# EAGLE schematic master_node_1284p (EAGLE 6.5.0)
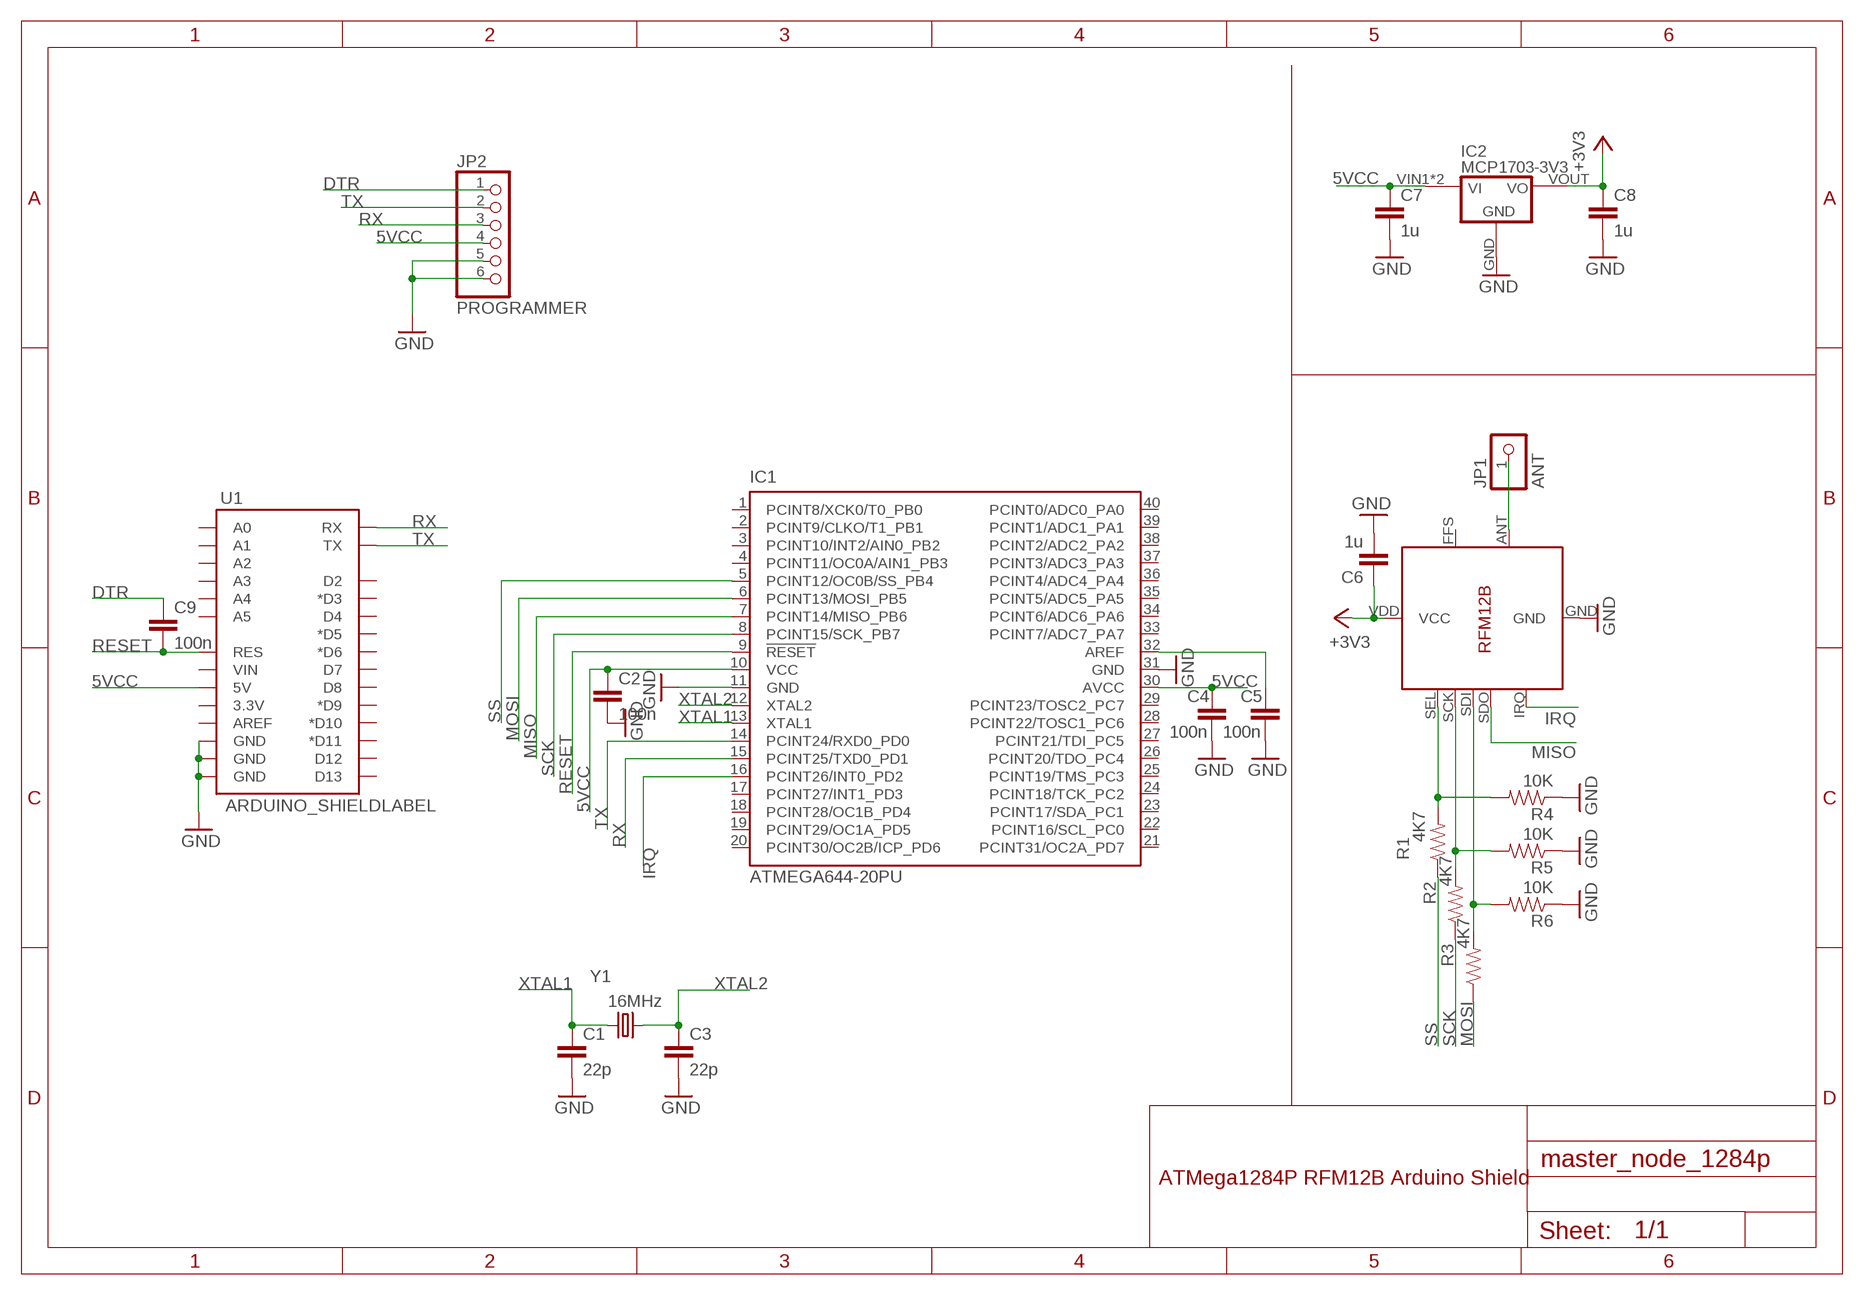
[diagram p0: schematic, sheet 1]

## Parts
C1  22p  C-EUC0805K  [C0805K]
C2  100n  C-EUC0805K  [C0805K]
C3  22p  C-EUC0805K  [C0805K]
C4  100n  C-EUC0805K  [C0805K]
C5  100n  C-EUC0805K  [C0805K]
C6  1u  CAP0805  [0805]
C7  1u  CAP0805  [0805]
C8  1u  CAP0805  [0805]
C9  100n  C-EUC0805K  [C0805K]
IC1  ATMEGA644-20PU  [DIL40]
IC2  MCP1703-3V3  MCP1703-SOT89  [MCP1703-SOT89]
JP1  ANT  PINHD-1X1  [1X01]
JP2  PROGRAMMER  PINHD-1X6/90  [1X06/90]
R1  4K7  RESISTOR0805-RES  [0805]
R2  4K7  RESISTOR0805-RES  [0805]
R3  4K7  RESISTOR0805-RES  [0805]
R4  10K  RESISTOR0805-RES  [0805]
R5  10K  RESISTOR0805-RES  [0805]
R6  10K  RESISTOR0805-RES  [0805]
U1  ARDUINO_SHIELDLABEL  [DUEMILANOVE_SHIELD]
U$1  RFM12B  [RFM12B]
Y1  16MHz  CRYSTALHC49US  [HC49US]

## Nets
5VCC: C2.1 C4.1 C7.1 IC1.10(VCC) IC1.30(AVCC) IC2.VIN1(VI) IC2.VIN2(VI) JP2.4 U1.5V
+3V3: C6.1 C8.1 IC2.VOUT(VO) U$1.VDD(VCC)
DTR: C9.1 JP2.1
GND: C1.2 C2.2 C3.2 C4.2 C5.2 C6.2 C7.2 C8.2 IC1.11(GND) IC1.31(GND) IC2.GND JP2.5 JP2.6 R4.1 R5.1 R6.1 U1.GND@0(GND) U1.GND@1(GND) U1.GND@2(GND) U$1.GND
IRQ: IC1.16(PCINT26/INT0_PD2) U$1.IRQ
MISO: IC1.7(PCINT14/MISO_PB6) U$1.SDO
MOSI: IC1.6(PCINT13/MOSI_PB5) R3.1
N$7: JP1.1 U$1.ANT
N$18: C5.1 IC1.32(AREF)
N$35: R3.2 R6.2 U$1.SDI
N$36: R2.2 R5.2 U$1.SCK
N$37: R1.2 R4.2 U$1.SEL
RESET: C9.2 IC1.9(!RESET) U1.RES
RX: IC1.15(PCINT25/TXD0_PD1) JP2.3 U1.RX
SCK: IC1.8(PCINT15/SCK_PB7) R2.1
SS: IC1.5(PCINT12/OC0B/SS_PB4) R1.1
TX: IC1.14(PCINT24/RXD0_PD0) JP2.2 U1.TX
XTAL1: C1.1 IC1.13(XTAL1) Y1.1
XTAL2: C3.1 IC1.12(XTAL2) Y1.2
Unconnected: IC1.1(PCINT8/XCK0/T0_PB0) IC1.2(PCINT9/CLKO/T1_PB1) IC1.3(PCINT10/INT2/AIN0_PB2) IC1.4(PCINT11/OC0A/AIN1_PB3) IC1.17(PCINT27/INT1_PD3) IC1.18(PCINT28/OC1B_PD4) IC1.19(PCINT29/OC1A_PD5) IC1.20(PCINT30/OC2B/ICP_PD6) IC1.21(PCINT31/OC2A_PD7) IC1.22(PCINT16/SCL_PC0) IC1.23(PCINT17/SDA_PC1) IC1.24(PCINT18/TCK_PC2) IC1.25(PCINT19/TMS_PC3) IC1.26(PCINT20/TDO_PC4) IC1.27(PCINT21/TDI_PC5) IC1.28(PCINT22/TOSC1_PC6) IC1.29(PCINT23/TOSC2_PC7) IC1.33(PCINT7/ADC7_PA7) IC1.34(PCINT6/ADC6_PA6) IC1.35(PCINT5/ADC5_PA5) IC1.36(PCINT4/ADC4_PA4) IC1.37(PCINT3/ADC3_PA3) IC1.38(PCINT2/ADC2_PA2) IC1.39(PCINT1/ADC1_PA1) IC1.40(PCINT0/ADC0_PA0) U1.3.3V U1.A0 U1.A1 U1.A2 U1.A3 U1.A4 U1.A5 U1.AREF U1.D2 U1.D3(*D3) U1.D4 U1.D5(*D5) U1.D6(*D6) U1.D7 U1.D8 U1.D9(*D9) U1.D10(*D10) U1.D11(*D11) U1.D12 U1.D13 U1.VIN U$1.FFS

## Notes on the sheet
- ATMega1284P RFM12B Arduino Shield

## Library data of the parts
C1-C5 C9 = resistor:C-EU: CAPACITOR, European symbol
C6-C8 = SparkFun-Passives:CAP: Capacitor Standard 0603 ceramic capacitor, and 0.1" leaded capacitor.
IC1 = atmel:ATMEGA644-*PU: 8-bit Microcontroller with 64K Bytes In-System Programmable Flash Auto generated by make-symbol-device-package-bsdl.ulp Rev. 34 Source: http://www.atmel.com/dyn/resources/prod_documents/doc2593.pdf; MPN: ATMEGA644-20PU; OC_FARNELL: 1288340; OC_NEWARK: 23M5060
IC2 = MCP1703_SOT89:MCP1703-SOT89
JP1 = pinhead:PINHD-1X1: PIN HEADER
JP2 = pinhead:PINHD-1X6: PIN HEADER
R1-R6 = SparkFun-Resistors:RESISTOR: Resistor Basic schematic elements and footprints for 0603, 1206, and PTH resistors.
U1 = SparkFun-Boards:ARDUINO_SHIELD: Arduino shield footprint
U$1 = JeeParts:RFM12B
Y1 = SparkFun-FreqCtrl:CRYSTAL: Various standard crystals. Proven footprints. Spark Fun Electronics SKU : COM-00534